# EAGLE design Sensor_Template (EAGLE 8.2.1)
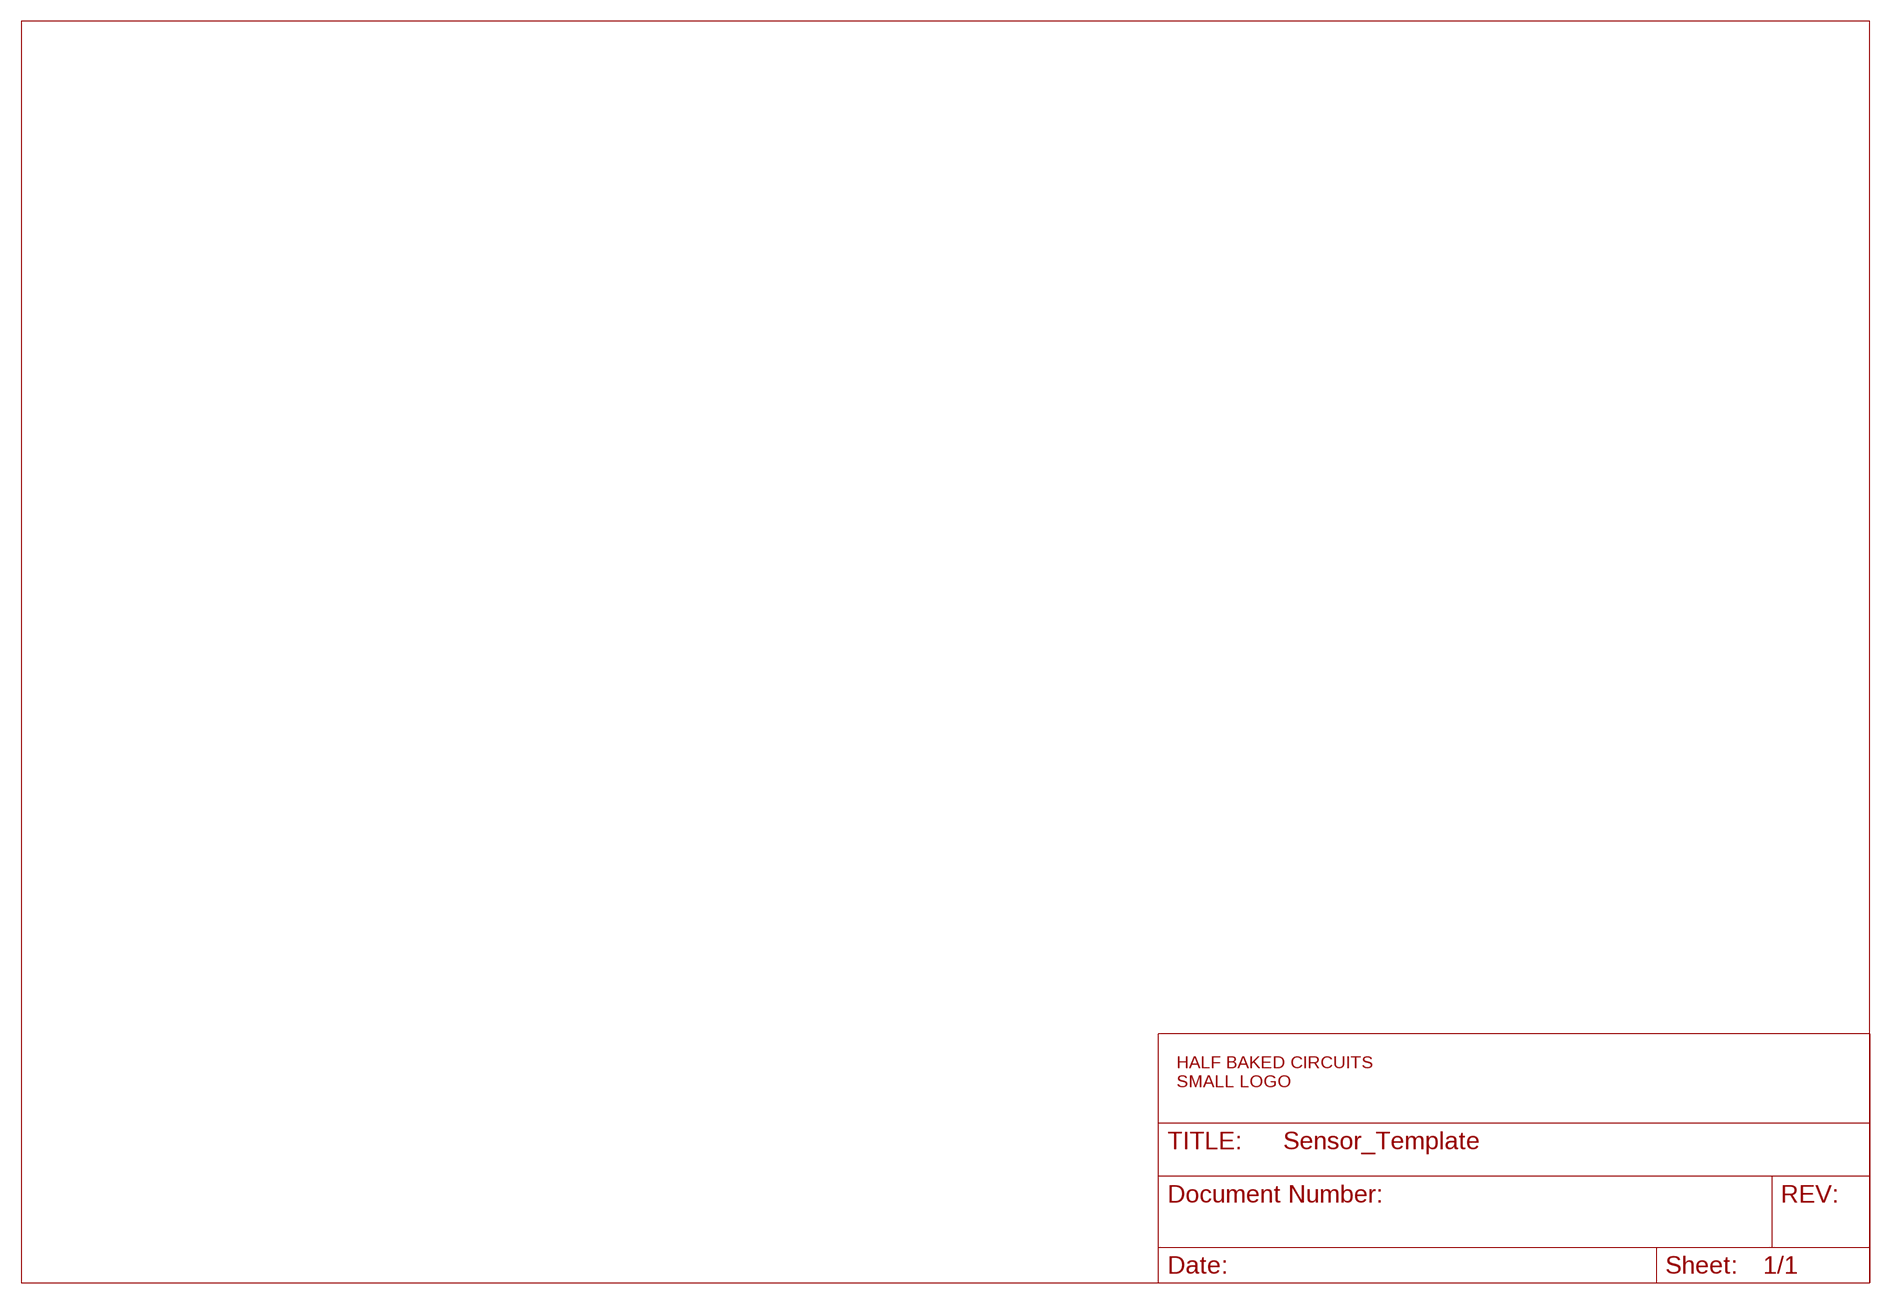
[diagram p0: schematic, sheet 1]

## Parts
U$1  HBC-LOGO-SMALL  [HBC-LOGO-SMALL]

## Library data of the parts
U$1 = HalfBakedCircuits:HBC-LOGO-SMALL

## Board
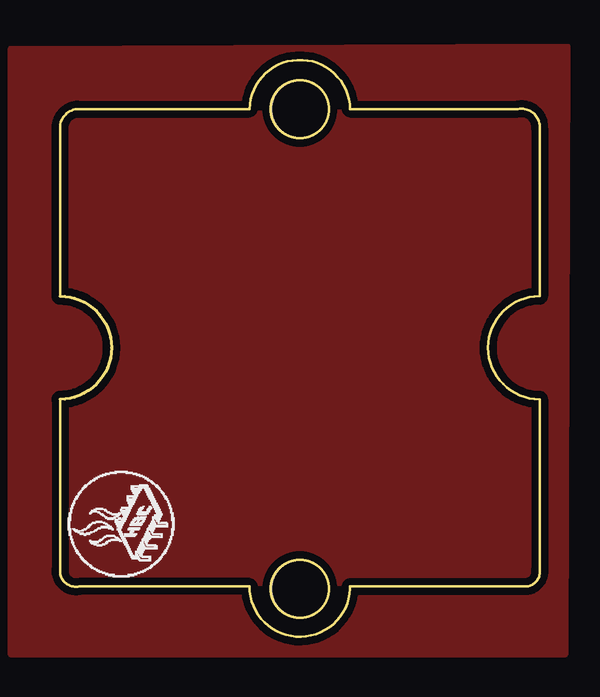
[diagram p1: board, top side]
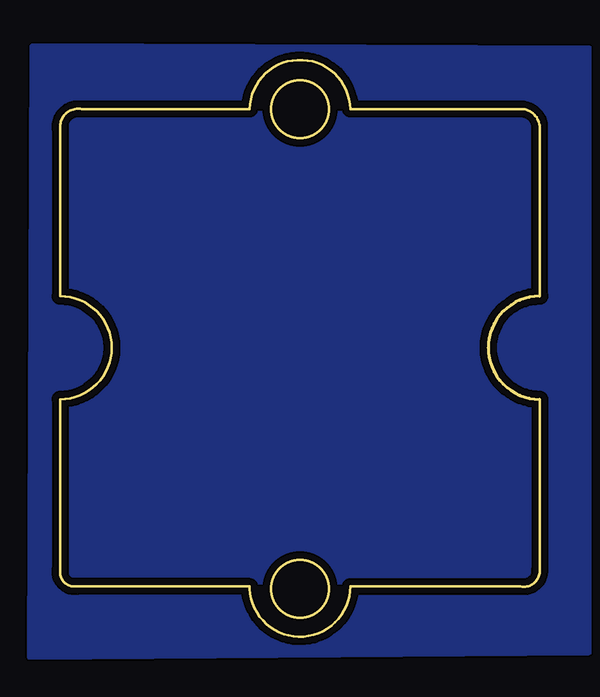
[diagram p2: board, bottom side, seen from below]

Size 20.01 x 24.05 mm. Coordinates in mm from the lower left corner, seen from the top.
Outline: 7.9,2.1 arc177 12.1,2 12.1,2.1 19.3,2.1 arc109 20,2.8 20,9.9 arc-180 20,14.2 20,21.2 arc106 19.1,22 12.1,22 arc177 7.9,22 0.7,22 arc76 0,21.3 0,14.2 arc-180 0,9.9 0,2.8 arc107 0.8,2.1 7.9,2.1
Outline: circle at 10,2 radius 1.2
Outline: circle at 10,22 radius 1.2
Copper layers (1*16): Top 0.035mm / dielectric 1.5mm / Bottom 0.035mm
Design rules "default": minimum track width 6mil, minimum drill 12mil, track to track 6mil, track to pad 6mil, pad to pad 6mil, via to via 6mil, smd to smd 0mil, copper to edge 10mil, drill to drill 10mil, minimum pad ring 10mil, minimum via ring 6mil, stop-mask expansion 2mil, vias tented up to drill 100mil, thermal gap 10mil
Holes 2.4 mm at 10,22 10,2

### Placement (x,y rotation side)
U$1  4.75,2.5 90 top

### Tracks (layer width: path | path; a pad name or v marks a point on that pad's centre or on a via)
GND
  pour Bottom (isolate 0.305): 21.27,-0.85 -2.04,-0.65 -2.04,24.52 21.17,24.62
  pour Top (isolate 0.305): 21.07,-0.75 -2.04,-0.75 -2.04,24.52 21.17,24.62